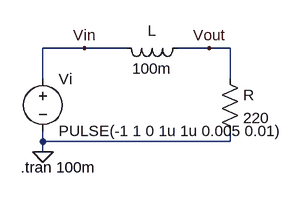
[diagram p0: schematic Draft13.asc]
Draft13.asc, the LTspice schematic file:
Version 4
SHEET 1 880 680
WIRE 176 80 112 80
WIRE 240 80 176 80
WIRE 368 80 320 80
WIRE 400 80 368 80
WIRE 112 128 112 80
WIRE 400 128 400 80
WIRE 112 224 112 208
WIRE 400 224 400 208
WIRE 400 224 112 224
WIRE 112 240 112 224
FLAG 112 240 0
FLAG 176 80 Vin
FLAG 368 80 Vout
SYMBOL voltage 112 112 R0
WINDOW 123 0 0 Left 0
WINDOW 39 0 0 Left 0
SYMATTR InstName Vi
SYMATTR Value PULSE(-1 1 0 1u 1u 0.005 0.01)
SYMBOL ind 336 64 R90
WINDOW 0 5 56 VBottom 2
WINDOW 3 32 56 VTop 2
SYMATTR InstName L
SYMATTR Value 100m
SYMBOL res 384 112 R0
SYMATTR InstName R
SYMATTR Value 220
SYMATTR SpiceLine tol=1 pwr=0.1
TEXT 78 264 Left 2 !.tran 100m

The netlist it stands for:
* Draft13.asc
Vi Vin 0 PULSE(-1 1 0 1u 1u 0.005 0.01)
L Vout Vin 100m
R Vout 0 220 tol=1 pwr=0.1
.tran 100m
.backanno
.end

* Results of the author's LTspice run, read from the files saved beside the schematic
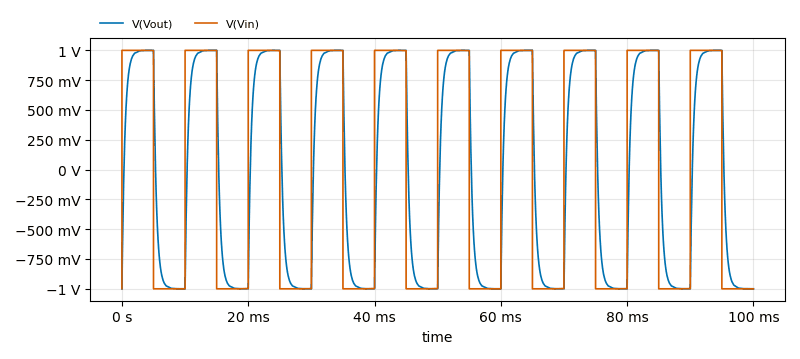
[diagram p1: Transient Analysis of Draft13.asc, plotted from the saved traces]
* Transient Analysis, 1 run:
*   V(Vout): min -1 V, max 1 V, average 202.8 µV, rms 904.3 mV, last -1 V
*   V(Vin): min -1 V, max 1 V, average 201.9 µV, rms 999.8 mV, last -1 V